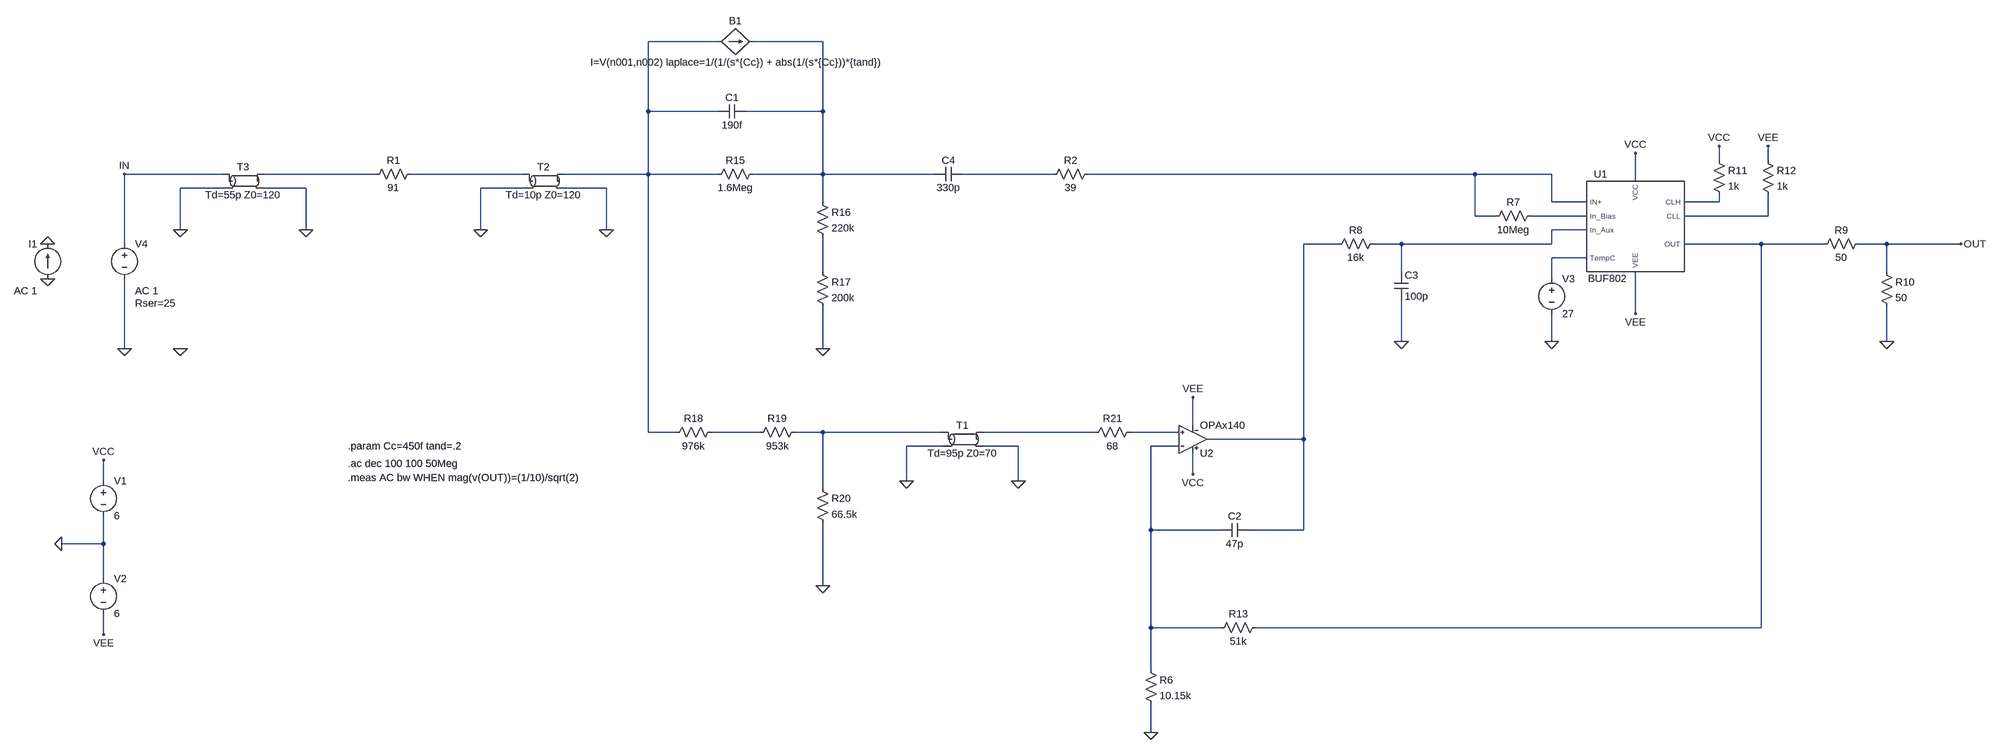
[diagram p0: schematic buf802-active-probe-lossy-capacitor.asc]
buf802-active-probe-lossy-capacitor.asc, the LTspice schematic file:
Version 4
SHEET 1 2152 1696
WIRE -880 -240 -1040 -240
WIRE -640 -240 -800 -240
WIRE -1040 -80 -1040 -240
WIRE -880 -80 -1040 -80
WIRE -640 -80 -640 -240
WIRE -640 -80 -816 -80
WIRE 1504 32 1504 0
WIRE 1616 32 1616 0
WIRE -2016 64 -2240 64
WIRE -1664 64 -1920 64
WIRE -1328 64 -1584 64
WIRE -1040 64 -1040 -80
WIRE -1040 64 -1232 64
WIRE -880 64 -1040 64
WIRE -640 64 -640 -80
WIRE -640 64 -800 64
WIRE -384 64 -640 64
WIRE -112 64 -320 64
WIRE 944 64 -32 64
WIRE 1120 64 944 64
WIRE 1312 80 1312 16
WIRE -2016 96 -2112 96
WIRE -1824 96 -1920 96
WIRE -1328 96 -1424 96
WIRE -1136 96 -1232 96
WIRE -640 128 -640 64
WIRE 1120 128 1120 64
WIRE 1200 128 1120 128
WIRE 1504 128 1504 112
WIRE 1504 128 1424 128
WIRE 944 160 944 64
WIRE 992 160 944 160
WIRE 1200 160 1072 160
WIRE 1616 160 1616 112
WIRE 1616 160 1424 160
WIRE -2112 192 -2112 96
WIRE -1824 192 -1824 96
WIRE -1424 192 -1424 96
WIRE -1136 192 -1136 96
WIRE 1200 192 1120 192
WIRE -2240 224 -2240 64
WIRE 560 224 480 224
WIRE 704 224 640 224
WIRE 1120 224 1120 192
WIRE 1120 224 704 224
WIRE 1600 224 1424 224
WIRE 1744 224 1600 224
WIRE 1888 224 1824 224
WIRE 2080 224 1888 224
WIRE 1200 256 1120 256
WIRE -640 288 -640 208
WIRE 704 288 704 224
WIRE 1888 288 1888 224
WIRE 1120 304 1120 256
WIRE 1312 384 1312 288
WIRE 704 448 704 352
WIRE 1120 448 1120 384
WIRE 1888 448 1888 368
WIRE -2240 464 -2240 304
WIRE -640 464 -640 368
WIRE 208 640 208 576
WIRE -1040 656 -1040 64
WIRE -976 656 -1040 656
WIRE -784 656 -896 656
WIRE -640 656 -704 656
WIRE -368 656 -640 656
WIRE -16 656 -272 656
WIRE 176 656 64 656
WIRE 480 672 480 224
WIRE 480 672 240 672
WIRE -368 688 -448 688
WIRE -192 688 -272 688
WIRE 176 688 112 688
WIRE 208 752 208 704
WIRE -2288 768 -2288 720
WIRE -448 768 -448 688
WIRE -192 768 -192 688
WIRE -640 784 -640 656
WIRE 112 880 112 688
WIRE 272 880 112 880
WIRE 480 880 480 672
WIRE 480 880 336 880
WIRE -2288 912 -2288 848
WIRE -2288 912 -2384 912
WIRE -2288 992 -2288 912
WIRE -640 1008 -640 864
WIRE 112 1104 112 880
WIRE 272 1104 112 1104
WIRE 1600 1104 1600 224
WIRE 1600 1104 352 1104
WIRE -2288 1120 -2288 1072
WIRE 112 1200 112 1104
WIRE 112 1344 112 1280
FLAG -2384 912 0
FLAG 1120 448 0
FLAG -2288 720 VCC
FLAG 1312 384 VEE
FLAG 1312 16 VCC
FLAG 1504 0 VCC
FLAG 1616 0 VEE
FLAG 208 752 VCC
FLAG 208 576 VEE
FLAG 112 1344 0
FLAG 704 448 0
FLAG 1888 448 0
FLAG 2080 224 OUT
FLAG -640 464 0
FLAG -640 1008 0
FLAG -2240 464 0
FLAG -448 768 0
FLAG -192 768 0
FLAG -2288 1120 VEE
FLAG -2416 304 0
FLAG -2416 224 0
FLAG -2112 192 0
FLAG -1824 192 0
FLAG -2112 464 0
FLAG -1424 192 0
FLAG -1136 192 0
FLAG -2240 64 IN
SYMBOL voltage -2288 752 R0
WINDOW 123 0 0 Left 0
WINDOW 39 0 0 Left 0
SYMATTR InstName V1
SYMATTR Value 6
SYMBOL voltage 1120 288 R0
WINDOW 123 0 0 Left 0
WINDOW 39 0 0 Left 0
SYMATTR InstName V3
SYMATTR Value 27
SYMBOL cap 336 864 R90
WINDOW 0 0 32 VBottom 2
WINDOW 3 32 32 VTop 2
SYMATTR InstName C2
SYMATTR Value 47p
SYMBOL res 96 1184 R0
SYMATTR InstName R6
SYMATTR Value 10.15k
SYMBOL res 976 176 R270
WINDOW 0 32 56 VTop 2
WINDOW 3 0 56 VBottom 2
SYMATTR InstName R7
SYMATTR Value 10Meg
SYMBOL res 544 240 R270
WINDOW 0 32 56 VTop 2
WINDOW 3 0 56 VBottom 2
SYMATTR InstName R8
SYMATTR Value 16k
SYMBOL cap 688 288 R0
SYMATTR InstName C3
SYMATTR Value 100p
SYMBOL res 1728 240 R270
WINDOW 0 32 56 VTop 2
WINDOW 3 0 56 VBottom 2
SYMATTR InstName R9
SYMATTR Value 50
SYMBOL res 1872 272 R0
SYMATTR InstName R10
SYMATTR Value 50
SYMBOL res 1488 16 R0
SYMATTR InstName R11
SYMATTR Value 1k
SYMBOL res 1600 16 R0
SYMATTR InstName R12
SYMATTR Value 1k
SYMBOL res 368 1088 R90
WINDOW 0 0 56 VBottom 2
WINDOW 3 32 56 VTop 2
SYMATTR InstName R13
SYMATTR Value 51k
SYMBOL BUF802 1296 176 R0
SYMATTR InstName U1
SYMBOL res -1568 48 R90
WINDOW 0 0 56 VBottom 2
WINDOW 3 32 56 VTop 2
SYMATTR InstName R1
SYMATTR Value 91
SYMBOL cap -320 48 R90
WINDOW 0 0 32 VBottom 2
WINDOW 3 32 32 VTop 2
SYMATTR InstName C4
SYMATTR Value 330p
SYMBOL res -784 48 R90
WINDOW 0 0 56 VBottom 2
WINDOW 3 32 56 VTop 2
SYMATTR InstName R15
SYMATTR Value 1.6Meg
SYMBOL res -656 112 R0
SYMATTR InstName R16
SYMATTR Value 220k
SYMBOL res -656 272 R0
SYMATTR InstName R17
SYMATTR Value 200k
SYMBOL res -880 640 R90
WINDOW 0 0 56 VBottom 2
WINDOW 3 32 56 VTop 2
SYMATTR InstName R18
SYMATTR Value 976k
SYMBOL res -688 640 R90
WINDOW 0 0 56 VBottom 2
WINDOW 3 32 56 VTop 2
SYMATTR InstName R19
SYMATTR Value 953k
SYMBOL res -656 768 R0
SYMATTR InstName R20
SYMATTR Value 66.5k
SYMBOL res 80 640 R90
WINDOW 0 0 56 VBottom 2
WINDOW 3 32 56 VTop 2
SYMATTR InstName R21
SYMATTR Value 68
SYMBOL voltage -2240 208 R0
WINDOW 123 24 124 Left 2
WINDOW 39 24 152 Left 2
SYMATTR Value2 AC 1
SYMATTR SpiceLine Rser=25
SYMATTR InstName V4
SYMATTR Value ""
SYMBOL tline -320 672 R0
SYMATTR InstName T1
SYMATTR Value Td=95p Z0=70
SYMBOL voltage -2288 976 R0
WINDOW 123 0 0 Left 0
WINDOW 39 0 0 Left 0
SYMATTR InstName V2
SYMATTR Value 6
SYMBOL OPAx140 208 672 M180
SYMATTR InstName U2
SYMBOL current -2416 304 R180
WINDOW 0 24 80 Left 2
WINDOW 3 24 0 Left 2
WINDOW 123 24 -28 Left 2
WINDOW 39 0 0 Left 0
SYMATTR InstName I1
SYMATTR Value ""
SYMATTR Value2 AC 1
SYMBOL tline -1968 80 R0
SYMATTR InstName T3
SYMATTR Value Td=55p Z0=120
SYMBOL tline -1280 80 R0
SYMATTR InstName T2
SYMATTR Value Td=10p Z0=120
SYMBOL res -16 48 R90
WINDOW 0 0 56 VBottom 2
WINDOW 3 32 56 VTop 2
SYMATTR InstName R2
SYMATTR Value 39
SYMBOL bi2 -800 -240 R90
WINDOW 0 -32 40 VBottom 2
WINDOW 3 32 40 VTop 2
SYMATTR InstName B1
SYMATTR Value I=V(n001,n002) laplace=1/(1/(s*{Cc}) + abs(1/(s*{Cc}))*{tand})
SYMBOL cap -816 -96 R90
WINDOW 0 0 32 VBottom 2
WINDOW 3 32 32 VTop 2
SYMATTR InstName C1
SYMATTR Value 190f
TEXT -1728 760 Left 2 !.meas AC bw WHEN mag(v(OUT))=(1/10)/sqrt(2)
TEXT -1728 728 Left 2 !.ac dec 100 100 50Meg
TEXT -1728 688 Left 2 !.param Cc=450f tand=.2

The netlist it stands for:
* buf802-active-probe-lossy-capacitor.asc
V1 VCC 0 6
V3 N013 0 27
C2 N011 N019 47p
R6 N019 0 10.15k
R7 N006 N008 10Meg
R8 N011 N010 16k
C3 N010 0 100p
R9 N012 OUT 50
R10 OUT 0 50
R11 VCC N007 1k
R12 VEE N009 1k
R13 N012 N019 51k
XU1 N006 N012 VCC VEE N007 N009 N008 N010 N013 BUF802  ; pins IN+ OUT VCC VEE CLH CLL In_Bias In_Aux TempC
R1 N004 N003 91
C4 N005 N002 330p
R15 N002 N001 1.6Meg
R16 N002 N014 220k
R17 N014 0 200k
R18 N015 N001 976k
R19 N016 N015 953k
R20 N016 0 66.5k
R21 N018 N017 68
V4 IN 0 AC 1 Rser=25
T1 N016 0 N017 0 Td=95p Z0=70
V2 0 VEE 6
XU2 N018 N019 VCC VEE N011 OPAx140  ; pins In+ In- V+ V- OUT
I1 0 0 AC 1
T3 IN 0 N003 0 Td=55p Z0=120
T2 N004 0 N001 0 Td=10p Z0=120
R2 N006 N005 39
B1 N001 N002 I=V(n001,n002) laplace=1/(1/(s*{Cc}) + abs(1/(s*{Cc}))*{tand})
C1 N002 N001 190f
.meas AC bw WHEN mag(v(OUT))=(1/10)/sqrt(2)
.ac dec 100 100 50Meg
.param Cc=450f tand=.2
.lib buf802.lib
.lib OPAx140.LIB
.backanno
.end